# Altium project Display_SACA.PrjPCB
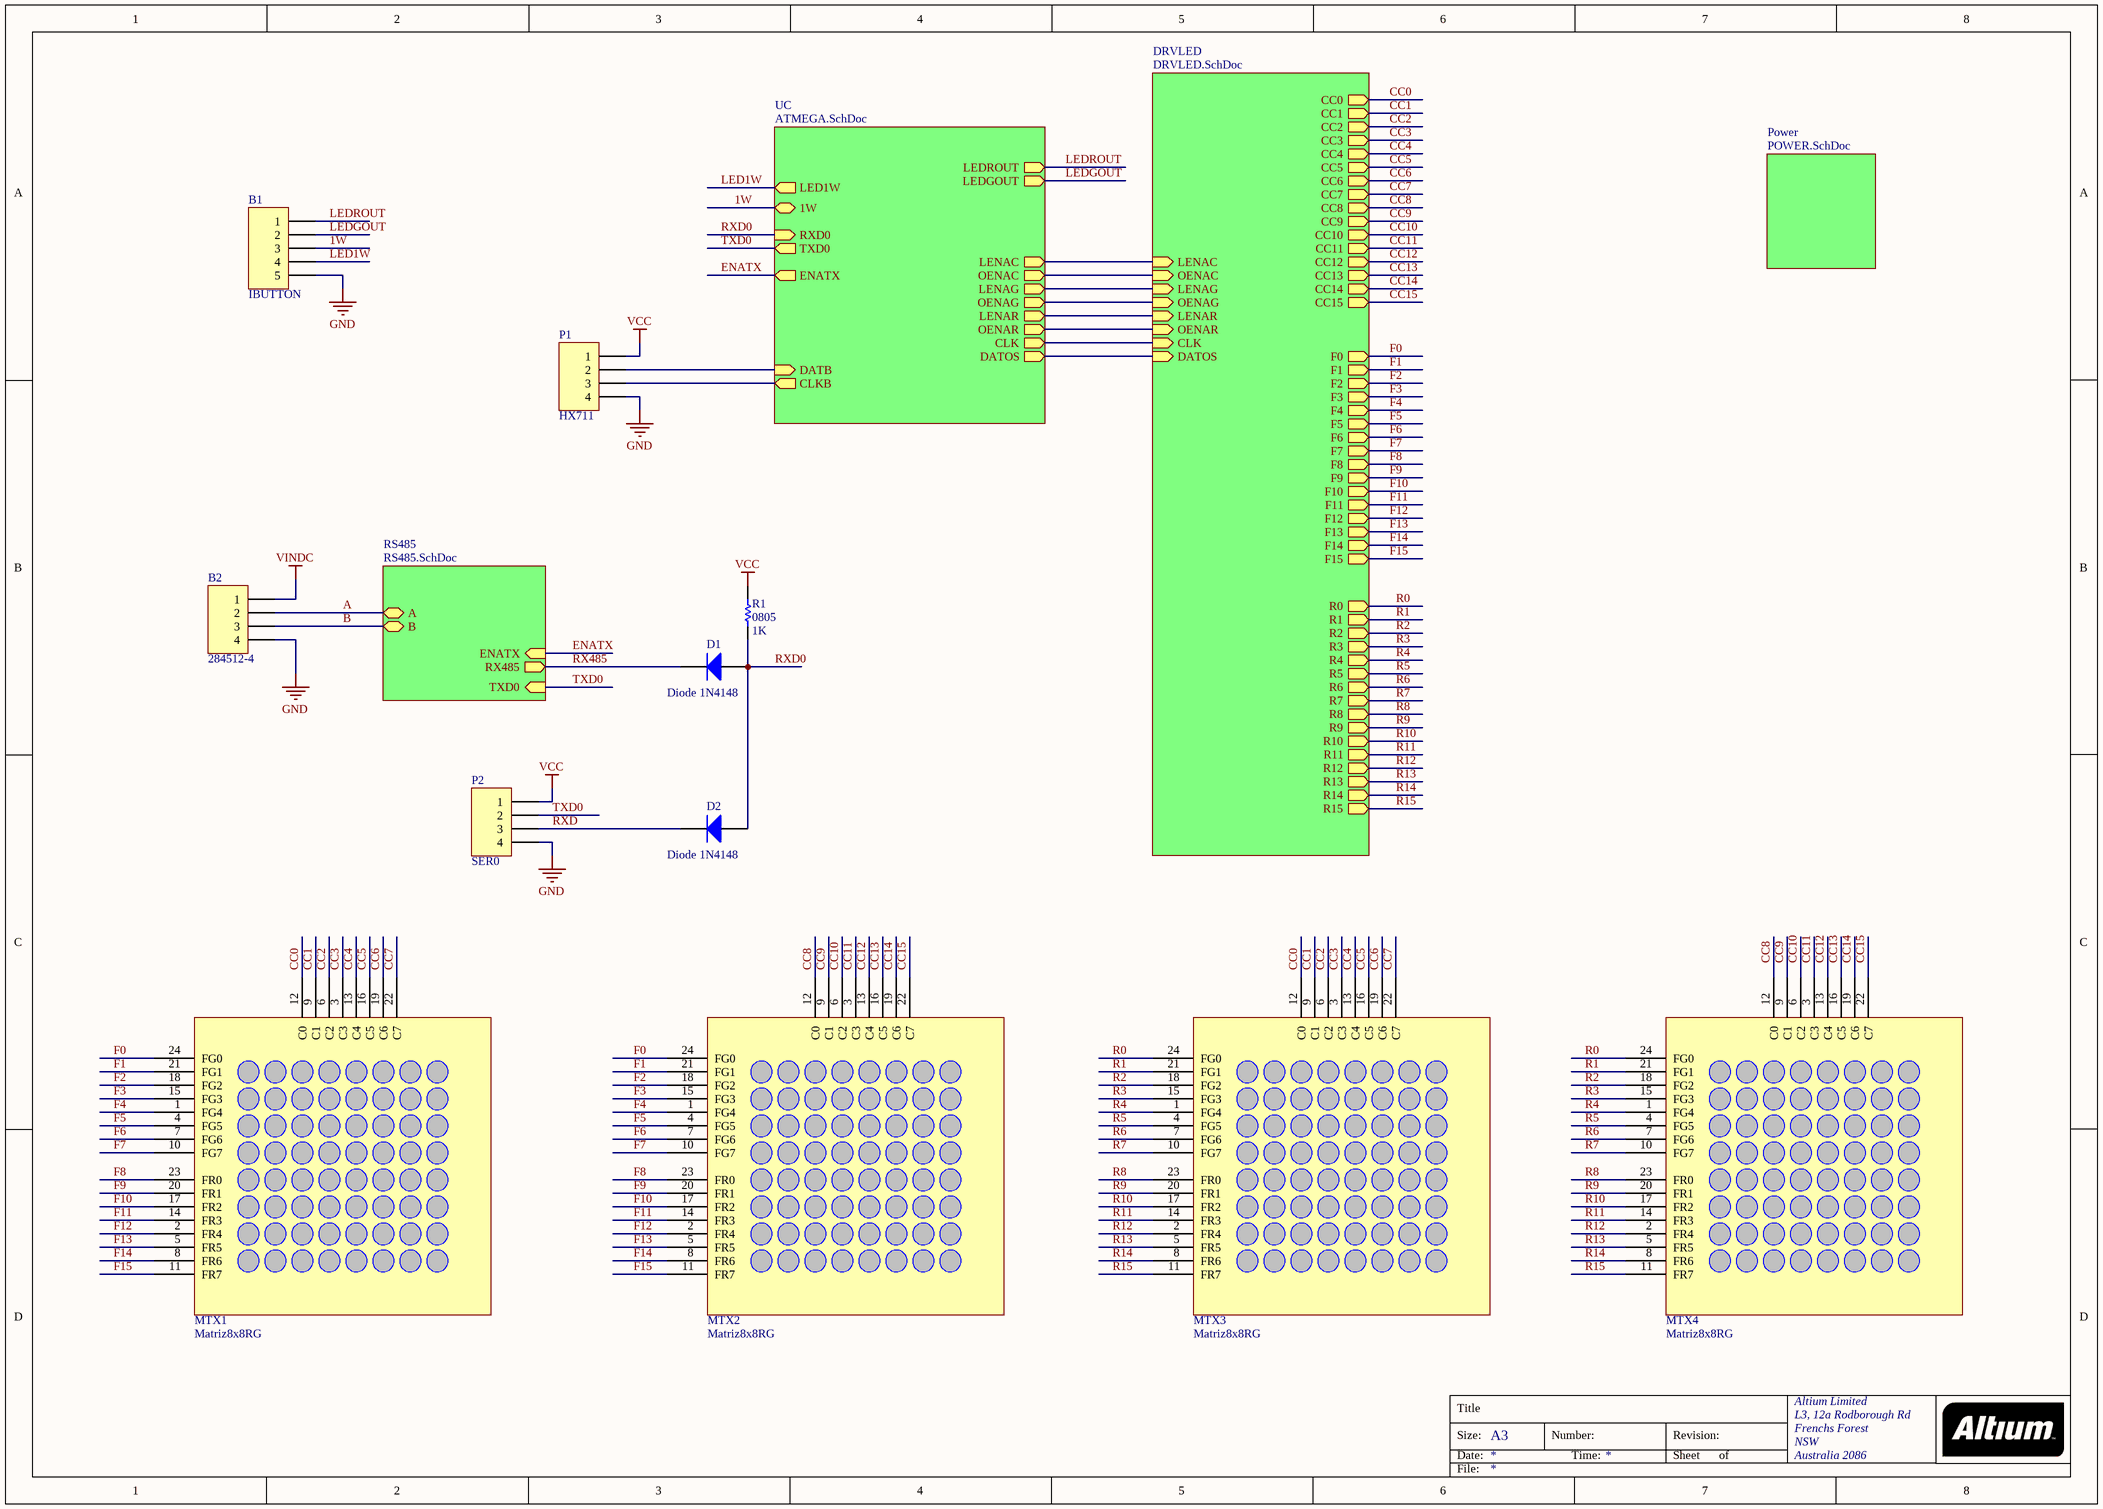
[diagram p0: Display_SACA.SchDoc]
5 sheets, 93 parts. Net scope: hierarchical (ports join the sheet entries above them; power ports are global).
Board file: Display_SACA.PcbDoc
Sheets:
  Display_SACA.SchDoc
    RS485 = RS485.SchDoc
    UC = ATMEGA.SchDoc
    DRVLED = DRVLED.SchDoc
    Power = POWER.SchDoc

## Sheet Display_SACA.SchDoc
size A3; Organization: Altium Limited; Address1: L3, 12a Rodborough Rd; Address2: Frenchs Forest; Address3: NSW; Address4: Australia 2086

### Parts
B1  IBUTTON  [BORNERA5-3.5]
B2  284512-4  [BORNERA4-3.5]
D1  Diode 1N4148  [1N4148SMD]
D2  Diode 1N4148  [1N4148SMD]
MTX1  Matriz8x8RG  [MatrizFuturlec]
MTX2  Matriz8x8RG  [MatrizFuturlec]
MTX3  Matriz8x8RG  [MatrizFuturlec]
MTX4  Matriz8x8RG  [MatrizFuturlec]
P1  HX711  [HDR1X4]
P2  SER0  [HDR1X4]
R1  0805  value 1K  [R0805]

### Sub-sheets
DRVLED = DRVLED.SchDoc: LENAC (in), OENAC (in), LENAG (in), OENAG (in), LENAR (in), OENAR (in), CLK (in), DATOS (in), CC0 (out), CC1 (out), CC2 (out), CC3 (out), CC4 (out), CC5 (out), CC6 (out), CC7 (out), F0 (out), F1 (out), F2 (out), F3 (out), F4 (out), F5 (out), F6 (out), F7 (out), F8 (out), F9 (out), F10 (out), F11 (out), F12 (out), F13 (out), F14 (out), F15 (out), R0 (out), R1 (out), R2 (out), R3 (out), R4 (out), R5 (out), R6 (out), R7 (out), R8 (out), R9 (out), R10 (out), R11 (out), R12 (out), R13 (out), R14 (out), R15 (out), CC8 (out), CC9 (out), CC10 (out), CC11 (out), CC12 (out), CC13 (out), CC14 (out), CC15 (out)
Power = POWER.SchDoc: no entries
RS485 = RS485.SchDoc: TXD0 (in), RX485 (out), A (bidir), B (bidir), ENATX (in)
UC = ATMEGA.SchDoc: 1W (bidir), RXD0 (in), TXD0 (out), ENATX (out), LEDGOUT (out), LEDROUT (out), LENAC (out), OENAC (out), LENAG (out), OENAG (out), LENAR (out), OENAR (out), CLK (out), DATOS (out), DATB (in), CLKB (out), LED1W (out)

### Nets
GND: B1.5 B2.4 P1.4 P2.4
VCC: P1.1 P2.1 R1.2
VINDC: B2.1
1W: B1.3 ; sheet UC/1W
A: B2.2 ; sheet RS485/A
B: B2.3 ; sheet RS485/B
CC0: MTX1.12(C0) MTX3.12(C0) ; sheet DRVLED/CC0
CC1: MTX1.9(C1) MTX3.9(C1) ; sheet DRVLED/CC1
CC2: MTX1.6(C2) MTX3.6(C2) ; sheet DRVLED/CC2
CC3: MTX1.3(C3) MTX3.3(C3) ; sheet DRVLED/CC3
CC4: MTX1.13(C4) MTX3.13(C4) ; sheet DRVLED/CC4
CC5: MTX1.16(C5) MTX3.16(C5) ; sheet DRVLED/CC5
CC6: MTX1.19(C6) MTX3.19(C6) ; sheet DRVLED/CC6
CC7: MTX1.22(C7) MTX3.22(C7) ; sheet DRVLED/CC7
CC8: MTX2.12(C0) MTX4.12(C0) ; sheet DRVLED/CC8
CC9: MTX2.9(C1) MTX4.9(C1) ; sheet DRVLED/CC9
CC10: MTX2.6(C2) MTX4.6(C2) ; sheet DRVLED/CC10
CC11: MTX2.3(C3) MTX4.3(C3) ; sheet DRVLED/CC11
CC12: MTX2.13(C4) MTX4.13(C4) ; sheet DRVLED/CC12
CC13: MTX2.16(C5) MTX4.16(C5) ; sheet DRVLED/CC13
CC14: MTX2.19(C6) MTX4.19(C6) ; sheet DRVLED/CC14
CC15: MTX2.22(C7) MTX4.22(C7) ; sheet DRVLED/CC15
CLK: sheet UC/CLK, sheet DRVLED/CLK
DATOS: sheet UC/DATOS, sheet DRVLED/DATOS
ENATX: sheet RS485/ENATX, sheet UC/ENATX
F0: MTX1.24(FG0) MTX2.24(FG0) ; sheet DRVLED/F0
F1: MTX1.21(FG1) MTX2.21(FG1) ; sheet DRVLED/F1
F2: MTX1.18(FG2) MTX2.18(FG2) ; sheet DRVLED/F2
F3: MTX1.15(FG3) MTX2.15(FG3) ; sheet DRVLED/F3
F4: MTX1.1(FG4) MTX2.1(FG4) ; sheet DRVLED/F4
F5: MTX1.4(FG5) MTX2.4(FG5) ; sheet DRVLED/F5
F6: MTX1.7(FG6) MTX2.7(FG6) ; sheet DRVLED/F6
F7: MTX1.10(FG7) MTX2.10(FG7) ; sheet DRVLED/F7
F8: MTX1.23(FR0) MTX2.23(FR0) ; sheet DRVLED/F8
F9: MTX1.20(FR1) MTX2.20(FR1) ; sheet DRVLED/F9
F10: MTX1.17(FR2) MTX2.17(FR2) ; sheet DRVLED/F10
F11: MTX1.14(FR3) MTX2.14(FR3) ; sheet DRVLED/F11
F12: MTX1.2(FR4) MTX2.2(FR4) ; sheet DRVLED/F12
F13: MTX1.5(FR5) MTX2.5(FR5) ; sheet DRVLED/F13
F14: MTX1.8(FR6) MTX2.8(FR6) ; sheet DRVLED/F14
F15: MTX1.11(FR7) MTX2.11(FR7) ; sheet DRVLED/F15
LED1W: B1.4 ; sheet UC/LED1W
LEDGOUT: B1.2 ; sheet UC/LEDGOUT
LEDROUT: B1.1 ; sheet UC/LEDROUT
R0: MTX3.24(FG0) MTX4.24(FG0) ; sheet DRVLED/R0
R1: MTX3.21(FG1) MTX4.21(FG1) ; sheet DRVLED/R1
R2: MTX3.18(FG2) MTX4.18(FG2) ; sheet DRVLED/R2
R3: MTX3.15(FG3) MTX4.15(FG3) ; sheet DRVLED/R3
R4: MTX3.1(FG4) MTX4.1(FG4) ; sheet DRVLED/R4
R5: MTX3.4(FG5) MTX4.4(FG5) ; sheet DRVLED/R5
R6: MTX3.7(FG6) MTX4.7(FG6) ; sheet DRVLED/R6
R7: MTX3.10(FG7) MTX4.10(FG7) ; sheet DRVLED/R7
R8: MTX3.23(FR0) MTX4.23(FR0) ; sheet DRVLED/R8
R9: MTX3.20(FR1) MTX4.20(FR1) ; sheet DRVLED/R9
R10: MTX3.17(FR2) MTX4.17(FR2) ; sheet DRVLED/R10
R11: MTX3.14(FR3) MTX4.14(FR3) ; sheet DRVLED/R11
R12: MTX3.2(FR4) MTX4.2(FR4) ; sheet DRVLED/R12
R13: MTX3.5(FR5) MTX4.5(FR5) ; sheet DRVLED/R13
R14: MTX3.8(FR6) MTX4.8(FR6) ; sheet DRVLED/R14
R15: MTX3.11(FR7) MTX4.11(FR7) ; sheet DRVLED/R15
RX485: D1.2(K) ; sheet RS485/RX485
RXD: D2.2(K) P2.3
RXD0: D1.1(A) D2.1(A) R1.1 ; sheet UC/RXD0
TXD0: P2.2 ; sheet RS485/TXD0, sheet UC/TXD0
NetP1_2: P1.2 ; sheet UC/DATB
NetP1_3: P1.3 ; sheet UC/CLKB
NetU1_1: sheet UC/OENAC, sheet DRVLED/OENAC
NetU1_2: sheet UC/LENAG, sheet DRVLED/LENAG
NetU1_9: sheet UC/OENAG, sheet DRVLED/OENAG
NetU1_10: sheet UC/LENAR, sheet DRVLED/LENAR
NetU1_11: sheet UC/OENAR, sheet DRVLED/OENAR
NetU1_32: sheet UC/LENAC, sheet DRVLED/LENAC

### Notes on the sheet
- Title
- Size:
- Date:
- A3
- Number:
- Time:
- Revision:
- Sheet
- of
- File:

### Library data of the parts
B1 = Bornera 5 3.5mm: Header, 5-Pin; Part: A98399-ND; Proveedor: Digikey; LatestRevisionDate: 17-Jul-2002; LatestRevisionNote: Re-released for DXP Platform.; Publisher: Altium Limited; Price: 0.20
B2 = BORNERA4-3.5: TERM BLOCK HEADER  4POS R/A 3.5MM; Part: A98398-ND; Proveedor: Digikey; LatestRevisionDate: 17-Jul-2002; LatestRevisionNote: Re-released for DXP Platform.; Publisher: Altium Limited; Price: 1.11
D1 D2 = Diode 1N4148: 1N4148; Part: 1N4148WTPMSCT; Proveedor: Digikey; Published: 8-Jun-2000; LatestRevisionDate: 17-Jul-2002; LatestRevisionNote: Re-released for DXP Platform.; PackageVersion: Sep-1996; PackageReference: SMC; Publisher: Altium Limited; Code_JEDEC: DO-214-AB; Price: 0.202
MTX1-MTX4 = Matriz8x8RG: MATRIZ8X8 RG Anodo Comun Columnas
P1 P2 = Header 4: Header, 4-Pin; LatestRevisionDate: 17-Jul-2002; LatestRevisionNote: Re-released for DXP Platform.; Publisher: Altium Limited
R1 = Res 0805 1K: Semiconductor Resistor; Part: 541-1.0KACT; Proveedor: Digikey; Published: 8-Jun-2000; LatestRevisionDate: 17-Jul-2002; LatestRevisionNote: Re-released for DXP Platform.; PackageReference: AXIAL-0.5; Publisher: Altium Limited; Price: 0.077

## Sheet RS485.SchDoc
size A4; Organization: Altium Limited; Address1: L3, 12a Rodborough Rd; Address2: Frenchs Forest; Address3: NSW; Address4: Australia 2086
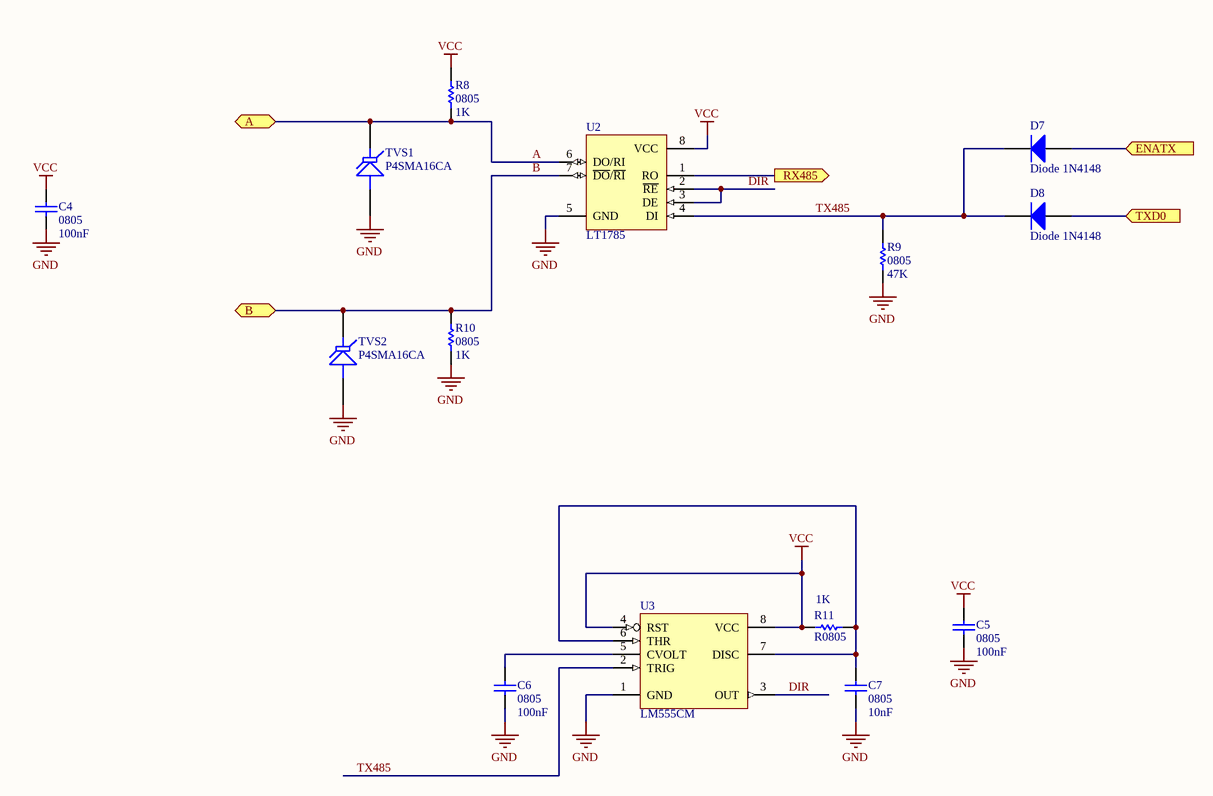
[diagram p1: RS485.SchDoc]

### Parts
C4  0805  value 100nF  [C0805C]
C5  0805  value 100nF  [C0805C]
C6  0805  value 100nF  [C0805C]
C7  0805  value 10nF  [C0805C]
D7  Diode 1N4148  [1N4148SMD]
D8  Diode 1N4148  [1N4148SMD]
R8  0805  value 1K  [R0805]
R9  0805  value 47K  [R0805]
R10  0805  value 1K  [R0805]
R11  R0805  value 1K  [R0805]
TVS1  P4SMA16CA  [TVS]
TVS2  P4SMA16CA  [TVS]
U2  LT1785  [M08A_N]
U3  LM555CM  [M08A_N]

### Ports
A (bidir), B (bidir), ENATX (in), RX485 (out), TXD0 (in)

### Nets
GND: C4.1 C5.1 C6.1 C7.1 R9.1 R10.1 TVS1.1(A) TVS2.1(A) U2.5(GND) U3.1(GND)
VCC: C4.2 C5.2 R8.2 R11.1 U2.8(VCC) U3.4(RST) U3.8(VCC)
A: R8.1 TVS1.2(K) U2.6(DO/RI) ; port A
B: R10.2 TVS2.2(K) U2.7(~{DO}/~{RI}) ; port B
DIR: U2.2(~{RE}) U2.3(DE) U3.3(OUT)
ENATX: D7.1(A) ; port ENATX
RX485: U2.1(RO) ; port RX485
TX485: D7.2(K) D8.2(K) R9.2 U2.4(DI) U3.2(TRIG)
TXD0: D8.1(A) ; port TXD0
NetC6_2: C6.2 U3.5(CVOLT)
NetC7_2: C7.2 R11.2 U3.6(THR) U3.7(DISC)

### Notes on the sheet
- Title
- Size:
- Date:
- A4
- Number:
- Time:
- Revision:
- Sheet
- of
- File:

### Library data of the parts
C4-C6 = Cap 0805: Cap 100nF 25V X7R; Part: 399-1170-1-ND; Proveedor: Digikey; Published: 8-Jun-2000; LatestRevisionDate: 17-Jul-2002; LatestRevisionNote: Re-released for DXP Platform.; PackageReference: C1206; Publisher: Altium Limited; Price: 0.05
C7 = Cap 0805 10nF: Cap 100nF 25V X7R; Part: 399-1158-1-ND; Proveedor: Digikey; Published: 8-Jun-2000; LatestRevisionDate: 17-Jul-2002; LatestRevisionNote: Re-released for DXP Platform.; PackageReference: C1206; Publisher: Altium Limited; Price: 0.1
D7 D8 = Diode 1N4148: as D1 on sheet Display_SACA; Published: 8-Jun-2000; LatestRevisionDate: 17-Jul-2002; LatestRevisionNote: Re-released for DXP Platform.; PackageVersion: Sep-1996; PackageReference: SMC; Publisher: Altium Limited; Code_JEDEC: DO-214-AB; Price: 0.202
R8 R10 = Res 0805 1K: as R1 on sheet Display_SACA; Published: 8-Jun-2000; LatestRevisionDate: 17-Jul-2002; LatestRevisionNote: Re-released for DXP Platform.; PackageReference: AXIAL-0.5; Publisher: Altium Limited; Price: 0.077
R9 = Res 0805 47K: Semiconductor Resistor; Part: 541-47KACT; Proveedor: Digikey; Published: 8-Jun-2000; LatestRevisionDate: 17-Jul-2002; LatestRevisionNote: Re-released for DXP Platform.; PackageReference: AXIAL-0.5; Publisher: Altium Limited; Price: 0.077
R11 = Res 0805 1K: Semiconductor Resistor; Part: 311-1.0KARCT-ND; Proveedor: Digikey; Published: 8-Jun-2000; LatestRevisionDate: 17-Jul-2002; LatestRevisionNote: Re-released for DXP Platform.; PackageReference: AXIAL-0.5; Publisher: Altium Limited; Price: 0.1
TVS1 TVS2 = Tranzorb: Part: P4SMA16CA-ND; Proveedor: Digikey; Published: 24-Mar-1999; LatestRevisionDate: 17-Jul-2002; LatestRevisionNote: Re-released for DXP Platform.; PackageReference: DO-7; Publisher: Altium Limited; Price: 0.27336
U2 = LT1785: IC TXRX RS485/RS422 60V 8-SOIC; Part: LT1785IS8#PBF; Proveedor: Digikey; Published: 15-Apr-2002; LatestRevisionDate: 06-Jun-2005; LatestRevisionNote: Stylized 3D Model Added.; DatasheetVersion: Jul-1998; PackageVersion: Sep-1997; PackageReference: N08E; Publisher: Altium Limited; PackageDescription: DIP; 8 Leads; Row Spacing 7.62 mm; Pitch 2.54 mm; ComponentLink1Description: Manufacturer Link; ComponentLink1URL: http://www.national.com/; ComponentLink2Description: Datasheet; ComponentLink2URL: http://www.national.com/ds.cgi/DS/DS75176B.pdf; ComponentLink3Description: URL Link1; ComponentLink3URL: http://www.national.com/pf/DS/DS75176B.html; Price: 4.77
U3 = LM555CM: Timer; Published: 15-Apr-2002; LatestRevisionDate: 13-Apr-2006; LatestRevisionNote: IPC-7351 Footprint Added.; DatasheetVersion: May-1997; PackageVersion: Sep-1997; PackageReference: M08A; Publisher: Altium Limited; PackageDescription: 8-Pin Small Outline Integrated Circuit 1.27 mm Pitch; Code_JEDEC: MS-012-AA; Code_IPC: SOIC127P600-8; ComponentLink1Description: Manufacturer Link; ComponentLink1URL: http://www.national.com/; ComponentLink2Description: Datasheet; ComponentLink2URL: http://www.national.com/ds.cgi/LM/LM555.pdf; ComponentLink3Description: URL Link1; ComponentLink3URL: http://www.national.com/pf/LM/LM555.html

## Sheet ATMEGA.SchDoc
size A4; Organization: Altium Limited; Address1: L3, 12a Rodborough Rd; Address2: Frenchs Forest; Address3: NSW; Address4: Australia 2086
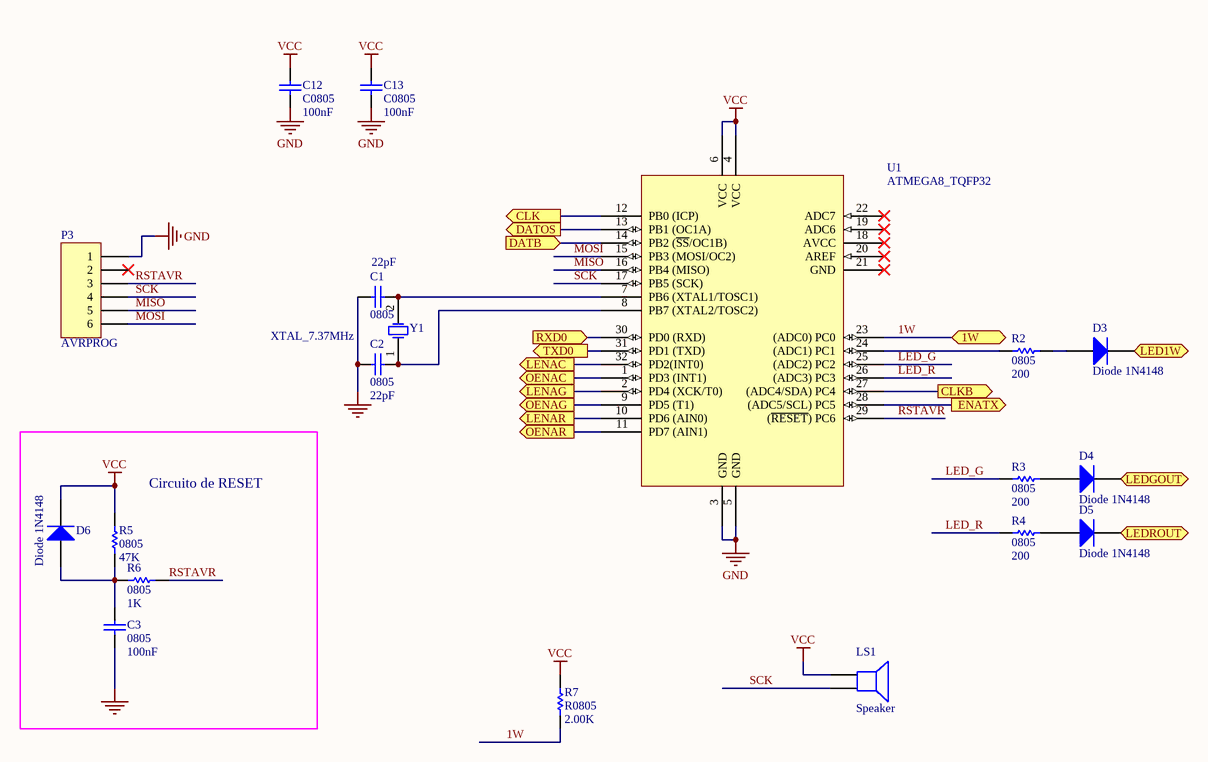
[diagram p2: ATMEGA.SchDoc]

### Parts
C1  0805  value 22pF  [C0805C]
C2  0805  value 22pF  [C0805C]
C3  0805  value 100nF  [C0805C]
C12  C0805  value 100nF  [C0805C]
C13  C0805  value 100nF  [C0805C]
D3  Diode 1N4148  [1N4148SMD]
D4  Diode 1N4148  [1N4148SMD]
D5  Diode 1N4148  [1N4148SMD]
D6  Diode 1N4148  [1N4148SMD]
LS1  Speaker  [PIN2]
P3  AVRPROG  [HDR1X6]
R2  0805  value 200  [R0805]
R3  0805  value 200  [R0805]
R4  0805  value 200  [R0805]
R5  0805  value 47K  [R0805]
R6  0805  value 1K  [R0805]
R7  R0805  value 2.00K  [R0805]
U1  ATMEGA8_TQFP32  [TQFP-32]
Y1  XTAL_7.37MHz  [CRYSTALSMD]

### Blocks framed on the sheet
Circuito de RESET: C3 D6 R5 R6

### Ports
1W (bidir), CLK (out), CLKB (out), DATB (in), DATOS (out), ENATX (out), LED1W (out), LEDGOUT (out), LEDROUT (out), LENAC (out), LENAG (out), LENAR (out), OENAC (out), OENAG (out), OENAR (out), RXD0 (in), TXD0 (out)

### Nets
GND: C1.1 C2.1 C3.1 C12.1 C13.1 P3.1 U1.3(GND) U1.5(GND)
VCC: C12.2 C13.2 D6.2(K) LS1.1 R5.2 R7.2 U1.4(VCC) U1.6(VCC)
1W: R7.1 U1.23((ADC0)_PC0) ; port 1W
CLK: U1.12(PB0_(ICP)) ; port CLK
DATOS: U1.13(PB1_(OC1A)) ; port DATOS
ENATX: U1.28((ADC5/SCL)_PC5) ; port ENATX
LED1W: D3.2(K) ; port LED1W
LED_G: R3.1 U1.25((ADC2)_PC2)
LED_R: R4.1 U1.26((ADC3)_PC3)
LEDGOUT: D4.2(K) ; port LEDGOUT
LEDROUT: D5.2(K) ; port LEDROUT
MISO: P3.5 U1.16(PB4_(MISO))
MOSI: P3.6 U1.15(PB3_(MOSI/OC2))
RSTAVR: P3.3 R6.2 U1.29((~{RESET})_PC6)
RXD0: U1.30(PD0_(RXD)) ; port RXD0
SCK: LS1.2 P3.4 U1.17(PB5_(SCK))
TXD0: U1.31(PD1_(TXD)) ; port TXD0
NetC1_2: C1.2 U1.7(PB6_(XTAL1/TOSC1)) Y1.2(OSC2)
NetC2_2: C2.2 U1.8(PB7_(XTAL2/TOSC2)) Y1.1(OSC1)
NetC3_2: C3.2 D6.1(A) R5.1 R6.1
NetD3_1: D3.1(A) R2.2
NetD4_1: D4.1(A) R3.2
NetD5_1: D5.1(A) R4.2
NetP1_2: U1.14(PB2_(~{SS}/OC1B)) ; port DATB
NetP1_3: U1.27((ADC4/SDA)_PC4) ; port CLKB
NetR2_1: R2.1 U1.24((ADC1)_PC1)
NetU1_1: U1.1(PD3_(INT1)) ; port OENAC
NetU1_2: U1.2(PD4_(XCK/T0)) ; port LENAG
NetU1_9: U1.9(PD5_(T1)) ; port OENAG
NetU1_10: U1.10(PD6_(AIN0)) ; port LENAR
NetU1_11: U1.11(PD7_(AIN1)) ; port OENAR
NetU1_32: U1.32(PD2(INT0)) ; port LENAC

Not connected (* = marked no-connect by the designer): P3 2*; U1 18(AVCC)* 19(ADC6)* 20(AREF)* 21(GND)* 22(ADC7)*

### Notes on the sheet
- Title
- Size:
- Date:
- A4
- Number:
- Time:
- Revision:
- Sheet
- of
- File:

### Library data of the parts
C1 C2 = Cap 0805 22pF: Cap 22pF; Part: 399-1113-1; Proveedor: Digikey; Published: 8-Jun-2000; LatestRevisionDate: 17-Jul-2002; LatestRevisionNote: Re-released for DXP Platform.; PackageReference: C1206; Publisher: Altium Limited; Price: 0.05
C3 = Cap 0805: as C4 on sheet RS485; Published: 8-Jun-2000; LatestRevisionDate: 17-Jul-2002; LatestRevisionNote: Re-released for DXP Platform.; PackageReference: C1206; Publisher: Altium Limited; Price: 0.05
C12 C13 = Cap 0805 100nF: Cap 100nF 25V X7R; Part: 399-1170-1-ND; Proveedor: Digikey; Published: 8-Jun-2000; LatestRevisionDate: 17-Jul-2002; LatestRevisionNote: Re-released for DXP Platform.; PackageReference: C1206; Publisher: Altium Limited; Price: 0.10
D3-D6 = Diode 1N4148: as D1 on sheet Display_SACA; Published: 8-Jun-2000; LatestRevisionDate: 17-Jul-2002; LatestRevisionNote: Re-released for DXP Platform.; PackageVersion: Sep-1996; PackageReference: SMC; Publisher: Altium Limited; Code_JEDEC: DO-214-AB
  D3-D5: Price: 0.14
  D6: Price: 0.202
LS1 = Speaker: Loudspeaker; Published: 24-Mar-1999; LatestRevisionDate: 17-Jul-2002; LatestRevisionNote: Re-released for DXP Platform.; PackageReference: PIN2; Publisher: Altium Limited
P3 = Header 6: Header, 6-Pin; LatestRevisionDate: 17-Jul-2002; LatestRevisionNote: Re-released for DXP Platform.; Publisher: Altium Limited
R2-R4 = Res 0805 200: Semiconductor Resistor; Part: 541-200ACT; Proveedor: Digikey; Published: 8-Jun-2000; LatestRevisionDate: 17-Jul-2002; LatestRevisionNote: Re-released for DXP Platform.; PackageReference: AXIAL-0.5; Publisher: Altium Limited; Price: 0.077
R5 = Res 0805 47K: as R9 on sheet RS485; Published: 8-Jun-2000; LatestRevisionDate: 17-Jul-2002; LatestRevisionNote: Re-released for DXP Platform.; PackageReference: AXIAL-0.5; Publisher: Altium Limited; Price: 0.077
R6 = Res 0805 1K: as R1 on sheet Display_SACA; Published: 8-Jun-2000; LatestRevisionDate: 17-Jul-2002; LatestRevisionNote: Re-released for DXP Platform.; PackageReference: AXIAL-0.5; Publisher: Altium Limited; Price: 0.077
R7 = Res 0805 2.00K: Semiconductor Resistor; Part: 311-2.0KARCT-ND; Proveedor: Digikey; Published: 8-Jun-2000; LatestRevisionDate: 17-Jul-2002; LatestRevisionNote: Re-released for DXP Platform.; PackageReference: AXIAL-0.5; Publisher: Altium Limited; Price: 0.1
U1 = ATMEGA8_TQFP32: Atmel Microcontroller - Library created by carel..  <www.mpfreezone.com>
Y1 = XTAL_7.37MHz: CRYSTAL 7.3728MHZ 18PF SMD; Part: 535-9088-1-ND; Proveedor: Digikey; Published: 8-Jun-2000; LatestRevisionDate: 17-Jul-2002; LatestRevisionNote: Re-released for DXP Platform.; PackageReference: R38; Publisher: Altium Limited; Price: 0.56

## Sheet DRVLED.SchDoc
size A4; Organization: Altium Limited; Address1: L3, 12a Rodborough Rd; Address2: Frenchs Forest; Address3: NSW; Address4: Australia 2086
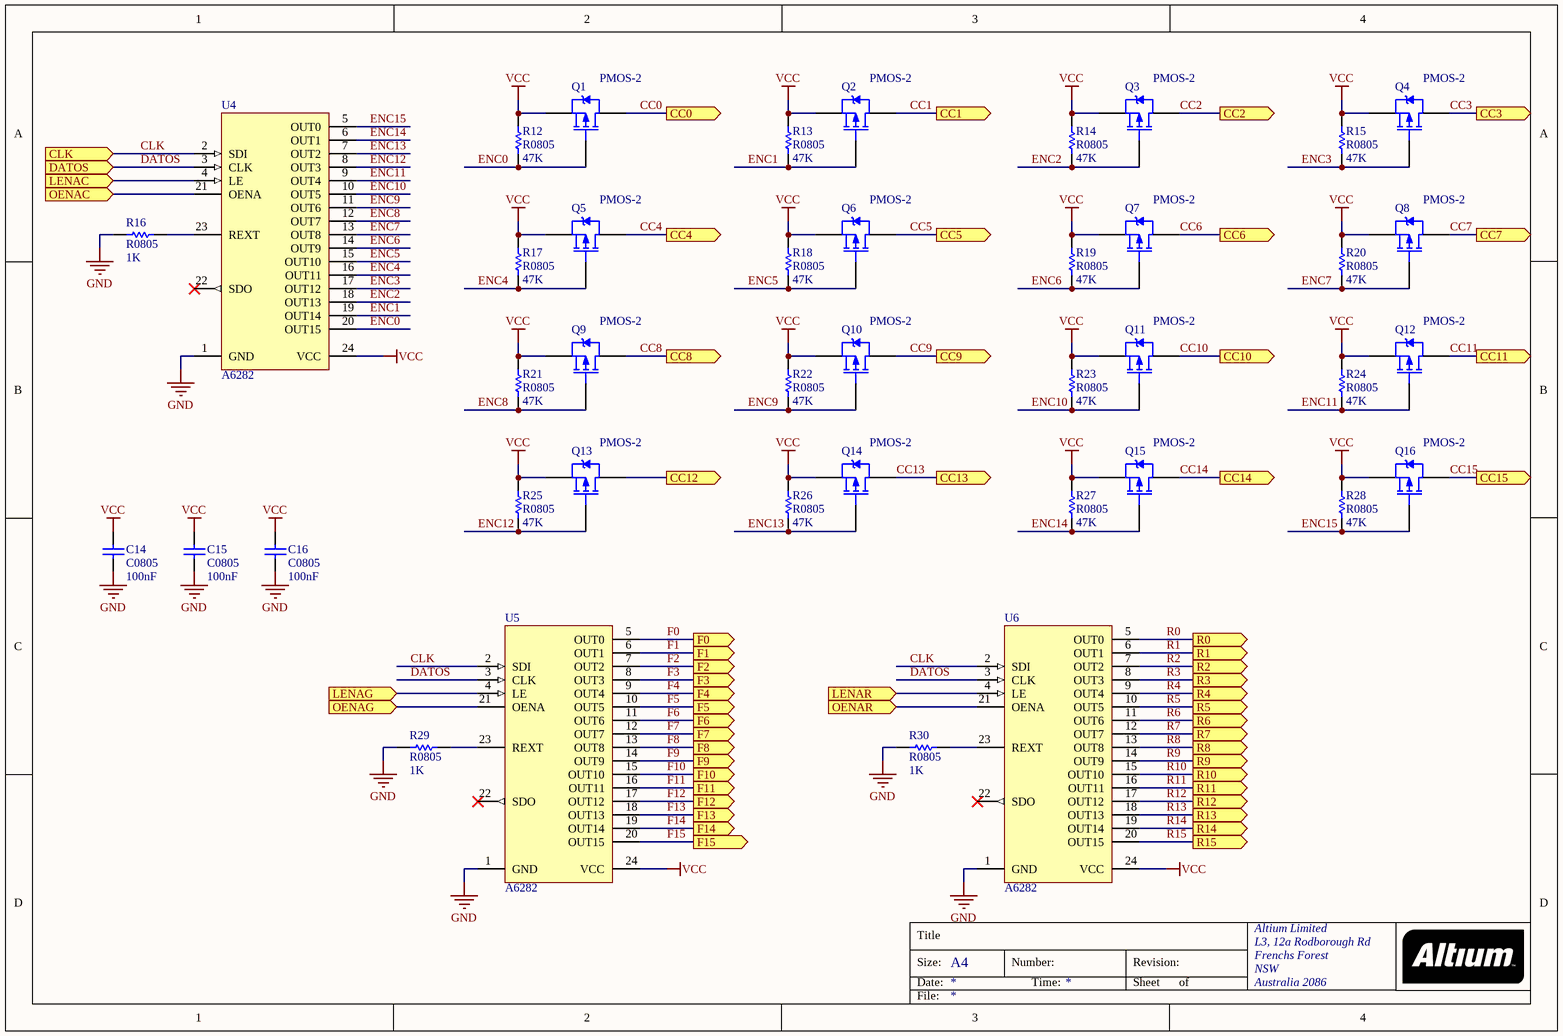
[diagram p3: DRVLED.SchDoc]

### Parts
C14  C0805  value 100nF  [C0805C]
C15  C0805  value 100nF  [C0805C]
C16  C0805  value 100nF  [C0805C]
Q1  PMOS-2  [SOT23MOS]
Q2  PMOS-2  [SOT23MOS]
Q3  PMOS-2  [SOT23MOS]
Q4  PMOS-2  [SOT23MOS]
Q5  PMOS-2  [SOT23MOS]
Q6  PMOS-2  [SOT23MOS]
Q7  PMOS-2  [SOT23MOS]
Q8  PMOS-2  [SOT23MOS]
Q9  PMOS-2  [SOT23MOS]
Q10  PMOS-2  [SOT23MOS]
Q11  PMOS-2  [SOT23MOS]
Q12  PMOS-2  [SOT23MOS]
Q13  PMOS-2  [SOT23MOS]
Q14  PMOS-2  [SOT23MOS]
Q15  PMOS-2  [SOT23MOS]
Q16  PMOS-2  [SOT23MOS]
R12  R0805  value 47K  [R0805]
R13  R0805  value 47K  [R0805]
R14  R0805  value 47K  [R0805]
R15  R0805  value 47K  [R0805]
R16  R0805  value 1K  [R0805]
R17  R0805  value 47K  [R0805]
R18  R0805  value 47K  [R0805]
R19  R0805  value 47K  [R0805]
R20  R0805  value 47K  [R0805]
R21  R0805  value 47K  [R0805]
R22  R0805  value 47K  [R0805]
R23  R0805  value 47K  [R0805]
R24  R0805  value 47K  [R0805]
R25  R0805  value 47K  [R0805]
R26  R0805  value 47K  [R0805]
R27  R0805  value 47K  [R0805]
R28  R0805  value 47K  [R0805]
R29  R0805  value 1K  [R0805]
R30  R0805  value 1K  [R0805]
U4  A6282  [SOP24]
U5  A6282  [SOP24]
U6  A6282  [SOP24]

### Ports
CC0 (out), CC1 (out), CC2 (out), CC3 (out), CC4 (out), CC5 (out), CC6 (out), CC7 (out), CC8 (out), CC9 (out), CC10 (out), CC11 (out), CC12 (out), CC13 (out), CC14 (out), CC15 (out), CLK (in), DATOS (in), F0 (out), F1 (out), F2 (out), F3 (out), F4 (out), F5 (out), F6 (out), F7 (out), F8 (out), F9 (out), F10 (out), F11 (out), F12 (out), F13 (out), F14 (out), F15 (out), LENAC (in), LENAG (in), LENAR (in), OENAC (in), OENAG (in), OENAR (in), R0 (out), R1 (out), R2 (out), R3 (out), R4 (out), R5 (out), R6 (out), R7 (out), R8 (out), R9 (out), R10 (out), R11 (out), R12 (out), R13 (out), R14 (out), R15 (out)

### Nets
GND: C14.1 C15.1 C16.1 R16.1 R29.1 R30.1 U4.1(GND) U5.1(GND) U6.1(GND)
VCC: C14.2 C15.2 C16.2 Q1.3(S) Q2.3(S) Q3.3(S) Q4.3(S) Q5.3(S) Q6.3(S) Q7.3(S) Q8.3(S) Q9.3(S) Q10.3(S) Q11.3(S) Q12.3(S) Q13.3(S) Q14.3(S) Q15.3(S) Q16.3(S) R12.2 R13.2 R14.2 R15.2 R17.2 R18.2 R19.2 R20.2 R21.2 R22.2 R23.2 R24.2 R25.2 R26.2 R27.2 R28.2 U4.24(VCC) U5.24(VCC) U6.24(VCC)
CC0: Q1.2(D) ; port CC0
CC1: Q2.2(D) ; port CC1
CC2: Q3.2(D) ; port CC2
CC3: Q4.2(D) ; port CC3
CC4: Q5.2(D) ; port CC4
CC5: Q6.2(D) ; port CC5
CC6: Q7.2(D) ; port CC6
CC7: Q8.2(D) ; port CC7
CC8: Q9.2(D) ; port CC8
CC9: Q10.2(D) ; port CC9
CC10: Q11.2(D) ; port CC10
CC11: Q12.2(D) ; port CC11
CC12: Q13.2(D) ; port CC12
CC13: Q14.2(D) ; port CC13
CC14: Q15.2(D) ; port CC14
CC15: Q16.2(D) ; port CC15
CLK: U4.2(SDI) U5.2(SDI) U6.2(SDI) ; port CLK
DATOS: U4.3(CLK) U5.3(CLK) U6.3(CLK) ; port DATOS
ENC0: Q1.1(G) R12.1 U4.20(OUT15)
ENC1: Q2.1(G) R13.1 U4.19(OUT14)
ENC2: Q3.1(G) R14.1 U4.18(OUT13)
ENC3: Q4.1(G) R15.1 U4.17(OUT12)
ENC4: Q5.1(G) R17.1 U4.16(OUT11)
ENC5: Q6.1(G) R18.1 U4.15(OUT10)
ENC6: Q7.1(G) R19.1 U4.14(OUT9)
ENC7: Q8.1(G) R20.1 U4.13(OUT8)
ENC8: Q9.1(G) R21.1 U4.12(OUT7)
ENC9: Q10.1(G) R22.1 U4.11(OUT6)
ENC10: Q11.1(G) R23.1 U4.10(OUT5)
ENC11: Q12.1(G) R24.1 U4.9(OUT4)
ENC12: Q13.1(G) R25.1 U4.8(OUT3)
ENC13: Q14.1(G) R26.1 U4.7(OUT2)
ENC14: Q15.1(G) R27.1 U4.6(OUT1)
ENC15: Q16.1(G) R28.1 U4.5(OUT0)
F0: U5.5(OUT0) ; port F0
F1: U5.6(OUT1) ; port F1
F2: U5.7(OUT2) ; port F2
F3: U5.8(OUT3) ; port F3
F4: U5.9(OUT4) ; port F4
F5: U5.10(OUT5) ; port F5
F6: U5.11(OUT6) ; port F6
F7: U5.12(OUT7) ; port F7
F8: U5.13(OUT8) ; port F8
F9: U5.14(OUT9) ; port F9
F10: U5.15(OUT10) ; port F10
F11: U5.16(OUT11) ; port F11
F12: U5.17(OUT12) ; port F12
F13: U5.18(OUT13) ; port F13
F14: U5.19(OUT14) ; port F14
F15: U5.20(OUT15) ; port F15
R0: U6.5(OUT0) ; port R0
R1: U6.6(OUT1) ; port R1
R2: U6.7(OUT2) ; port R2
R3: U6.8(OUT3) ; port R3
R4: U6.9(OUT4) ; port R4
R5: U6.10(OUT5) ; port R5
R6: U6.11(OUT6) ; port R6
R7: U6.12(OUT7) ; port R7
R8: U6.13(OUT8) ; port R8
R9: U6.14(OUT9) ; port R9
R10: U6.15(OUT10) ; port R10
R11: U6.16(OUT11) ; port R11
R12: U6.17(OUT12) ; port R12
R13: U6.18(OUT13) ; port R13
R14: U6.19(OUT14) ; port R14
R15: U6.20(OUT15) ; port R15
NetR16_2: R16.2 U4.23(REXT)
NetR29_2: R29.2 U5.23(REXT)
NetR30_2: R30.2 U6.23(REXT)
NetU1_1: U4.21(OENA) ; port OENAC
NetU1_2: U5.4(LE) ; port LENAG
NetU1_9: U5.21(OENA) ; port OENAG
NetU1_10: U6.4(LE) ; port LENAR
NetU1_11: U6.21(OENA) ; port OENAR
NetU1_32: U4.4(LE) ; port LENAC

Not connected (* = marked no-connect by the designer): U4 22(SDO)*; U5 22(SDO)*; U6 22(SDO)*

### Notes on the sheet
- Title
- Size:
- Date:
- A4
- Number:
- Time:
- Revision:
- Sheet
- of
- File:

### Library data of the parts
C14-C16 = Cap 0805 100nF: as C12 on sheet ATMEGA; Published: 8-Jun-2000; LatestRevisionDate: 17-Jul-2002; LatestRevisionNote: Re-released for DXP Platform.; PackageReference: C1206; Publisher: Altium Limited; Price: 0.10
Q1-Q16 = PMOS-2: P-Channel Power MOSFET; Note: Pin 4 not drawn and electrically connected to Pin 2.; Published: 8-Jun-2000; LatestRevisionDate: 17-Jul-2002; LatestRevisionNote: Re-released for DXP Platform.; DatasheetDocument: PD-9.390D; PackageReference: TO-220AB; Publisher: Altium Limited; Code_JEDEC: TO-220-AB; ComponentLink1Description: Manufacturer Link; ComponentLink1URL: http://www.irf.com/
R12-R15 R17-R28 = Res 0805 47K: Semiconductor Resistor; Part: 311-47KARCT-ND; Proveedor: Digikey; Published: 8-Jun-2000; LatestRevisionDate: 17-Jul-2002; LatestRevisionNote: Re-released for DXP Platform.; PackageReference: AXIAL-0.5; Publisher: Altium Limited; Price: 0.1
R16 R29 R30 = Res 0805 1K: as R11 on sheet RS485; Published: 8-Jun-2000; LatestRevisionDate: 17-Jul-2002; LatestRevisionNote: Re-released for DXP Platform.; PackageReference: AXIAL-0.5; Publisher: Altium Limited; Price: 0.1
U4-U6 = A6282: 16 Bit Current Constant Driver; Manufacturer: Allegro; Class I: Interface; Published: 16 Enero 2004; Revision: July-2002: Re-released for DXP Platform.; Datasheet: Latest Revision: Sep-1998; Package Reference: DIP18; Publisher: Fernando Vasquez; Class II: Current Constant Driver

## Sheet POWER.SchDoc
size A4; Author: Fernando Vásquez; DrawnBy: Fernando Vásquez; Engineer: Fernando Vásquez; Organization: WATCHING; Address1: Joaquin Pinto E4-358; Address2: y Amazonas; Address3: Quito-Ecuador; Address4: www.watching.com.ec; Revision: FV; Rule: PcbType=ProtelPcb
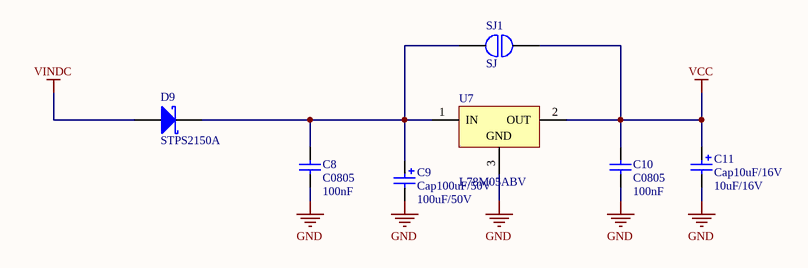
[diagram p4: POWER.SchDoc]

### Parts
?  (no value)  (graphical)
C8  C0805  value 100nF  [C0805C]
C9  Cap100uF/50V  value 100uF/50V  [CapPS]
C10  C0805  value 100nF  [C0805C]
C11  Cap10uF/16V  value 10uF/16V  [C0805T]
D9  STPS2150A  [DSO-C2/X2.3]
SJ1  SJ  [SJ]
U7  L78M05ABV  [TO220V]

### Nets
GND: C8.2 C9.2 C10.2 C11.2 U7.3(GND)
VCC: C10.1 C11.1 SJ1.2 U7.2(OUT)
VINDC: D9.1(A)
NetC8_1: C8.1 C9.1 D9.2(K) SJ1.1 U7.1(IN)

### Notes on the sheet
- Title
- Size:
- Date:
- Number:
- Time:
- Revision:
- Sheet
- of
- Place logo here
- File:

### Library data of the parts
? = Title Block Address(4)_Logo
C8 C10 = Cap 0805 100nF: as C12 on sheet ATMEGA; Published: 8-Jun-2000; LatestRevisionDate: 17-Jul-2002; LatestRevisionNote: Re-released for DXP Platform.; PackageReference: C1206; Publisher: Altium Limited; Price: 0.10
C9 = Cap100uF/50V: Part: P5182-ND; Published: 8-Jun-2000; LatestRevisionDate: 17-Jul-2002; LatestRevisionNote: Re-released for DXP Platform.; PackageReference: RB7.6-15; Publisher: Altium Limited; Price: 0.33
C11 = Cap10uF/16V: Cap Tant 10uF 16V 20% SMD; Part: 511-1473-1-ND; Proveedor: Digikey; Published: 8-Jun-2000; LatestRevisionDate: 17-Jul-2002; LatestRevisionNote: Re-released for DXP Platform.; PackageReference: C0805; Publisher: Altium Limited; Price: 0.65
D9 = STPS2150A: Schottky Rectifier; Part: 497-2467-1-ND; Proveedor: Digikey; Published: 8-Jun-2000; LatestRevisionDate: 17-Jul-2002; LatestRevisionNote: Re-released for DXP Platform.; DatasheetVersion: Dec-1997; PackageReference: DO-204AL; Publisher: Altium Limited; Code_JEDEC: DO-204-AL; ComponentLink1Description: Manufacturer Link; ComponentLink1URL: http://www.irf.com/; ComponentLink2Description: Datasheet; ComponentLink2URL: http://www.irf.com/product-info/datasheets/data/11dq03.pdf; Price: 0.49
SJ1 = SJ: Solder Junction
U7 = L78M05ABV: Precision 500mA Regulator; Note: Tab is connected to pin 3 (GND).; Published: 24-Aug-2001; LatestRevisionDate: 17-Jul-2002; LatestRevisionNote: Re-released for DXP Platform.; DatasheetVersion: Mar-1997; PackageReference: TO220V; Publisher: Altium Limited; PackageDescription: TO, Thru-Hole, Vertical, Heatsink Mounted; 3 In-Line Leads; Pitch 2.54 mm; Pin sequence 1, 3, 2; ComponentLink1Description: Manufacturer Link; ComponentLink1URL: http://www.st.com/; ComponentLink2Description: Datasheet; ComponentLink2URL: http://www.st.com/stonline/products/literature/ds/2147/l78m05ab.pdf

## Nets that join several sheets
GND: Display_SACA (B1.5 B2.4 P1.4 P2.4), RS485 (10 pins), ATMEGA (8 pins), DRVLED (9 pins), POWER (5 pins)
VCC: Display_SACA (P1.1 P2.1 R1.2), RS485 (7 pins), ATMEGA (8 pins), DRVLED (38 pins), POWER (C10.1 C11.1 SJ1.2 U7.2)
VINDC: Display_SACA (B2.1), POWER (D9.1)
1W: Display_SACA (B1.3), ATMEGA (R7.1 U1.23)
A: Display_SACA (B2.2), RS485 (R8.1 TVS1.2 U2.6)
B: Display_SACA (B2.3), RS485 (R10.2 TVS2.2 U2.7)
CC0: Display_SACA (MTX1.12 MTX3.12), DRVLED (Q1.2)
CC1: Display_SACA (MTX1.9 MTX3.9), DRVLED (Q2.2)
CC2: Display_SACA (MTX1.6 MTX3.6), DRVLED (Q3.2)
CC3: Display_SACA (MTX1.3 MTX3.3), DRVLED (Q4.2)
CC4: Display_SACA (MTX1.13 MTX3.13), DRVLED (Q5.2)
CC5: Display_SACA (MTX1.16 MTX3.16), DRVLED (Q6.2)
CC6: Display_SACA (MTX1.19 MTX3.19), DRVLED (Q7.2)
CC7: Display_SACA (MTX1.22 MTX3.22), DRVLED (Q8.2)
CC8: Display_SACA (MTX2.12 MTX4.12), DRVLED (Q9.2)
CC9: Display_SACA (MTX2.9 MTX4.9), DRVLED (Q10.2)
CC10: Display_SACA (MTX2.6 MTX4.6), DRVLED (Q11.2)
CC11: Display_SACA (MTX2.3 MTX4.3), DRVLED (Q12.2)
CC12: Display_SACA (MTX2.13 MTX4.13), DRVLED (Q13.2)
CC13: Display_SACA (MTX2.16 MTX4.16), DRVLED (Q14.2)
CC14: Display_SACA (MTX2.19 MTX4.19), DRVLED (Q15.2)
CC15: Display_SACA (MTX2.22 MTX4.22), DRVLED (Q16.2)
CLK: ATMEGA (U1.12), DRVLED (U4.2 U5.2 U6.2)
DATOS: ATMEGA (U1.13), DRVLED (U4.3 U5.3 U6.3)
ENATX: RS485 (D7.1), ATMEGA (U1.28)
F0: Display_SACA (MTX1.24 MTX2.24), DRVLED (U5.5)
F1: Display_SACA (MTX1.21 MTX2.21), DRVLED (U5.6)
F2: Display_SACA (MTX1.18 MTX2.18), DRVLED (U5.7)
F3: Display_SACA (MTX1.15 MTX2.15), DRVLED (U5.8)
F4: Display_SACA (MTX1.1 MTX2.1), DRVLED (U5.9)
F5: Display_SACA (MTX1.4 MTX2.4), DRVLED (U5.10)
F6: Display_SACA (MTX1.7 MTX2.7), DRVLED (U5.11)
F7: Display_SACA (MTX1.10 MTX2.10), DRVLED (U5.12)
F8: Display_SACA (MTX1.23 MTX2.23), DRVLED (U5.13)
F9: Display_SACA (MTX1.20 MTX2.20), DRVLED (U5.14)
F10: Display_SACA (MTX1.17 MTX2.17), DRVLED (U5.15)
F11: Display_SACA (MTX1.14 MTX2.14), DRVLED (U5.16)
F12: Display_SACA (MTX1.2 MTX2.2), DRVLED (U5.17)
F13: Display_SACA (MTX1.5 MTX2.5), DRVLED (U5.18)
F14: Display_SACA (MTX1.8 MTX2.8), DRVLED (U5.19)
F15: Display_SACA (MTX1.11 MTX2.11), DRVLED (U5.20)
LED1W: Display_SACA (B1.4), ATMEGA (D3.2)
LEDGOUT: Display_SACA (B1.2), ATMEGA (D4.2)
LEDROUT: Display_SACA (B1.1), ATMEGA (D5.2)
NetP1_2: Display_SACA (P1.2), ATMEGA (U1.14)
NetP1_3: Display_SACA (P1.3), ATMEGA (U1.27)
NetU1_1: ATMEGA (U1.1), DRVLED (U4.21)
NetU1_2: ATMEGA (U1.2), DRVLED (U5.4)
NetU1_9: ATMEGA (U1.9), DRVLED (U5.21)
NetU1_10: ATMEGA (U1.10), DRVLED (U6.4)
NetU1_11: ATMEGA (U1.11), DRVLED (U6.21)
NetU1_32: ATMEGA (U1.32), DRVLED (U4.4)
R0: Display_SACA (MTX3.24 MTX4.24), DRVLED (U6.5)
R1: Display_SACA (MTX3.21 MTX4.21), DRVLED (U6.6)
R2: Display_SACA (MTX3.18 MTX4.18), DRVLED (U6.7)
R3: Display_SACA (MTX3.15 MTX4.15), DRVLED (U6.8)
R4: Display_SACA (MTX3.1 MTX4.1), DRVLED (U6.9)
R5: Display_SACA (MTX3.4 MTX4.4), DRVLED (U6.10)
R6: Display_SACA (MTX3.7 MTX4.7), DRVLED (U6.11)
R7: Display_SACA (MTX3.10 MTX4.10), DRVLED (U6.12)
R8: Display_SACA (MTX3.23 MTX4.23), DRVLED (U6.13)
R9: Display_SACA (MTX3.20 MTX4.20), DRVLED (U6.14)
R10: Display_SACA (MTX3.17 MTX4.17), DRVLED (U6.15)
R11: Display_SACA (MTX3.14 MTX4.14), DRVLED (U6.16)
R12: Display_SACA (MTX3.2 MTX4.2), DRVLED (U6.17)
R13: Display_SACA (MTX3.5 MTX4.5), DRVLED (U6.18)
R14: Display_SACA (MTX3.8 MTX4.8), DRVLED (U6.19)
R15: Display_SACA (MTX3.11 MTX4.11), DRVLED (U6.20)
RX485: Display_SACA (D1.2), RS485 (U2.1)
RXD0: Display_SACA (D1.1 D2.1 R1.1), ATMEGA (U1.30)
TXD0: Display_SACA (P2.2), RS485 (D8.1), ATMEGA (U1.31)